# Altium schematic sheet FTDI.SchDoc
size A3
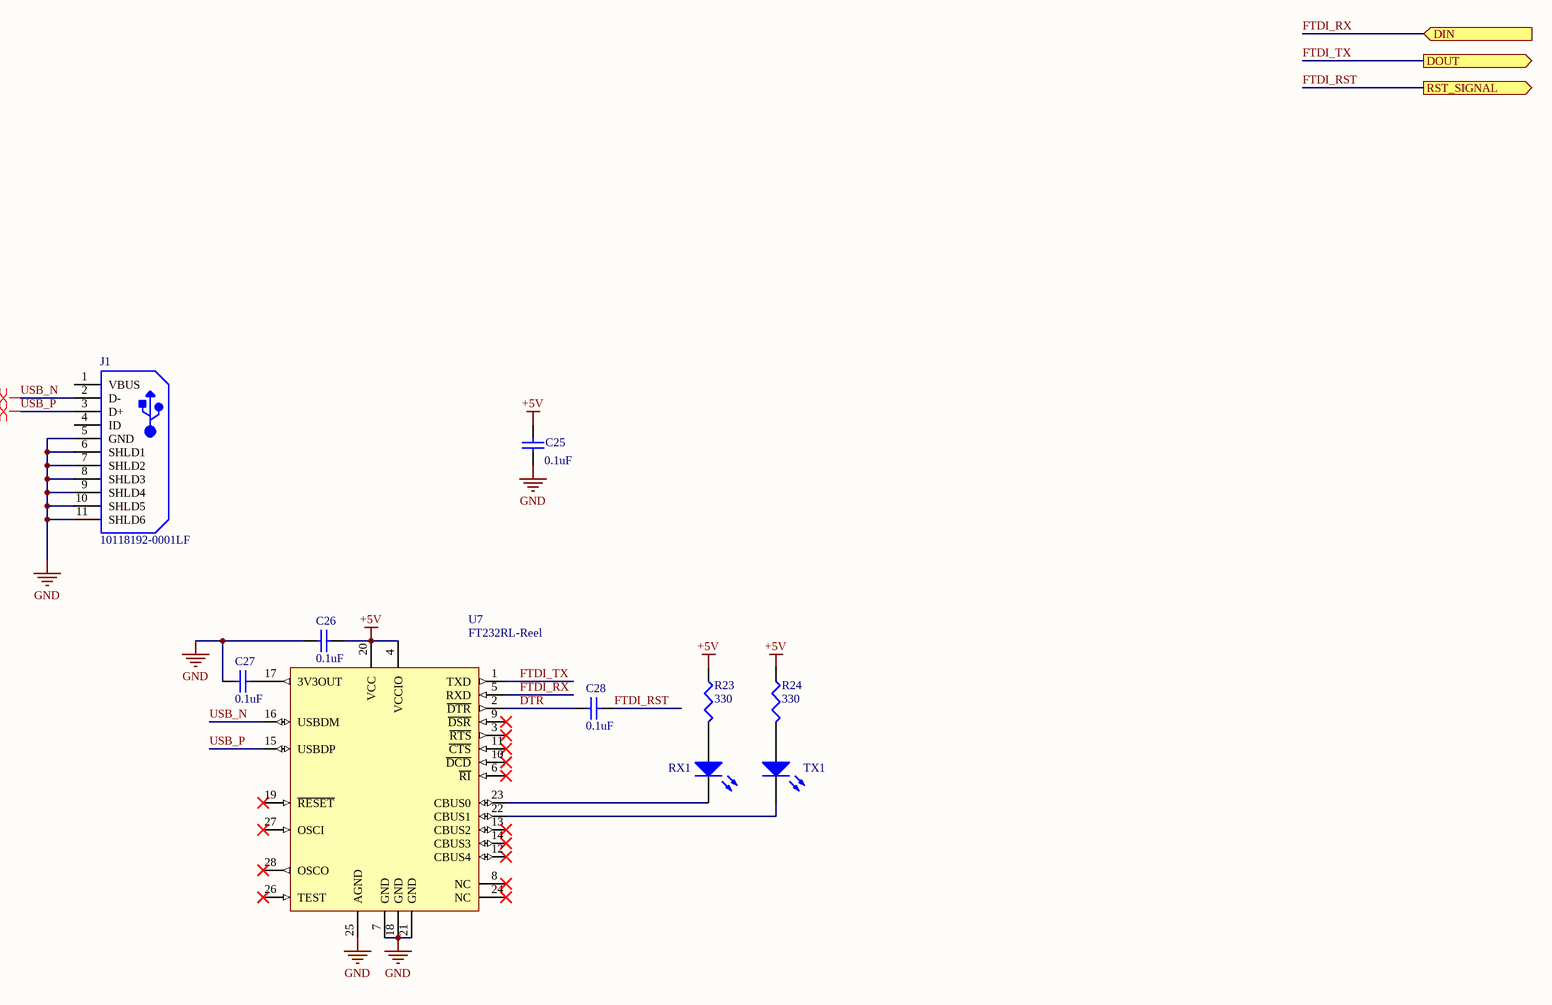
[diagram p0: FTDI.SchDoc]

## Parts
C25  value 0.1uF  [1608[0603]]  (hidden comment: Cap Semi)
C26  value 0.1uF  [1608[0603]]  (hidden comment: Cap Semi)
C27  value 0.1uF  [1608[0603]]  (hidden comment: Cap Semi)
C28  value 0.1uF  [1608[0603]]  (hidden comment: Cap Semi)
J1  10118192-0001LF  [FCI-10118192-0001LF-5_V]
R23  value 330  [J1-0603]  (hidden comment: Res3)
R24  value 330  [J1-0603]  (hidden comment: Res3)
RX1  150060RS75000  [0603_A]  (value not drawn)
TX1  150060RS75000  [0603_A]  (value not drawn)
U7  FT232RL-Reel  [SSOP-28_L]

## Ports
DIN (in), DOUT (out), RST_SIGNAL (out)

## Nets
+5V: C25.1 C26.2 R23.1 R24.1 U7.4(VCCIO) U7.20(VCC)
GND: C25.2 C26.1 C27.1 J1.5(GND) J1.6(SHLD1) J1.7(SHLD2) J1.8(SHLD3) J1.9(SHLD4) J1.10(SHLD5) J1.11(SHLD6) U7.7(GND) U7.18(GND) U7.21(GND) U7.25(AGND)
DTR: C28.1 U7.2(~{DTR})
FTDI_RST: C28.2 ; port RST_SIGNAL
FTDI_RX: U7.5(RXD) ; port DIN
FTDI_TX: U7.1(TXD) ; port DOUT
USB_N: J1.2(D-) U7.16(USBDM)
USB_P: J1.3(D+) U7.15(USBDP)
NetC27_2: C27.2 U7.17(3V3OUT)
NetR23_2: R23.2 RX1.2(A)
NetR24_2: R24.2 TX1.2(A)
NetRX1_1: RX1.1(K) U7.23(CBUS0)
NetTX1_1: TX1.1(K) U7.22(CBUS1)

Not connected (* = marked no-connect by the designer): J1 1(VBUS) 4(ID); U7 3(~{RTS})* 6(~{RI})* 8(NC)* 9(~{DSR})* 10(~{DCD})* 11(~{CTS})* 12(CBUS4)* 13(CBUS2)* 14(CBUS3)* 19(~{RESET})* 24(NC)* 26(TEST)* 27(OSCI)* 28(OSCO)*

## Layout directives
differential pair: USB_N, USB_P

## Notes on the sheet
- Title
- Size:
- Date:
- A3
- Number:
- Time:
- Revision:
- Sheet
- of
- File:

## Library data of the parts
C25-C28 = Cap Semi: Capacitor (Semiconductor SIM Model); Published: 8-Jun-2000; LatestRevisionDate: 29-May-2009; LatestRevisionNote: IPC-7351 Footprint Added.; PackageReference: C1206; Publisher: Altium Limited; PackageDescription: Chip Capacitor; Supplier 1: Digi-Key; Supplier Part Number 1: 490-10901-1-ND
J1 = CMP-2000-05118-1: Micro USB B Type Receptacle, -55 to 85 degC, 5-Pin SMD, RoHS, Tape and Reel; Manufacturer: FCI; Current Rating: 1.8A; Number of Contacts: 5Contact; Mounting Angle: Right; Insulation Resistance: 1000MOhms; Connector Type: MicroUSBTypeBreceptacle; Gender: Female; Packaging: Reel; Termination Style: SMD/SMT; Product Category: USBConnectors; RoHS: Details; Flammability Rating: UL94V-0; Standard: USB2.0; Brand: FCI; Manufacturer URL: http://www.fci.com/; Product: MicroUSBTypeBConnectors; Operating Temperature Range: -55Cto+85C; Datasheet Version: Rev. B, 05/2015; Contact Material: CopperAlloy; Contact Plating: Gold; Datasheet URL: http://www.mouser.com/ds/2/154/10118192-793027.pdf; Color: Black; Factory Pack Quantity: 1400
R23 R24 = Res3: Resistor; Published: 8-Jun-2000; LatestRevisionDate: 29-May-2009; LatestRevisionNote: IPC-7351 Footprint Added.; PackageReference: J1-0603; Publisher: Altium Limited; PackageDescription: Chip Resistor; Supplier 1: Digi-Key; Supplier Part Number 1: 311-330HRCT-ND
RX1 TX1 = CMP-1426-00001-1: SMD mono-color Chip LED, WL-SMCW, Red; Manufacturer: Wuerth Elektronik; Color: Red; PackageReference: 0603_A; ComponentLink2URL: http://katalog.we-online.com/led/datasheet/150060RS75000.pdf; ComponentLink1URL: http://www.we-online.com; ComponentLink1Description: Manufacturer URL; ComponentLink2Description: Datasheet; PartNumber: 150060RS75000; Supplier 1: Digi-Key; Supplier Part Number 1: 732-4978-1-ND
U7 = CMP-0078-00029-3: USB UART Asynchronous Serial Data Transfer Chip, 28-pin SSOP, Tape and Reel; Manufacturer: FTDI; PackageVersion: Mar-12; PackageReference: SSOP-28; ComponentLink2Description: Datasheet; DatasheetVersion: ver 2.10, Mar-2012; PackageDescription: 28-Pin Small Outline Package 0.65 mm Pitch; ComponentLink1Description: Manufacturer URL; RevisionNote: DatasheetVersion updated to 2.10 Mar-2012; PartNumber: FT232RL-Reel; ComponentLink1URL: http://www.ftdichip.com/; ComponentLink2URL: http://www.ftdichip.com/Support/Documents/DataSheets/ICs/DS_FT232R.pdf; Supplier 1: Digi-Key; Supplier Part Number 1: 768-1007-1-ND